# EAGLE schematic Talon_SDI12 (EAGLE 9.6.2)

## Sheet 1 of 3: Power
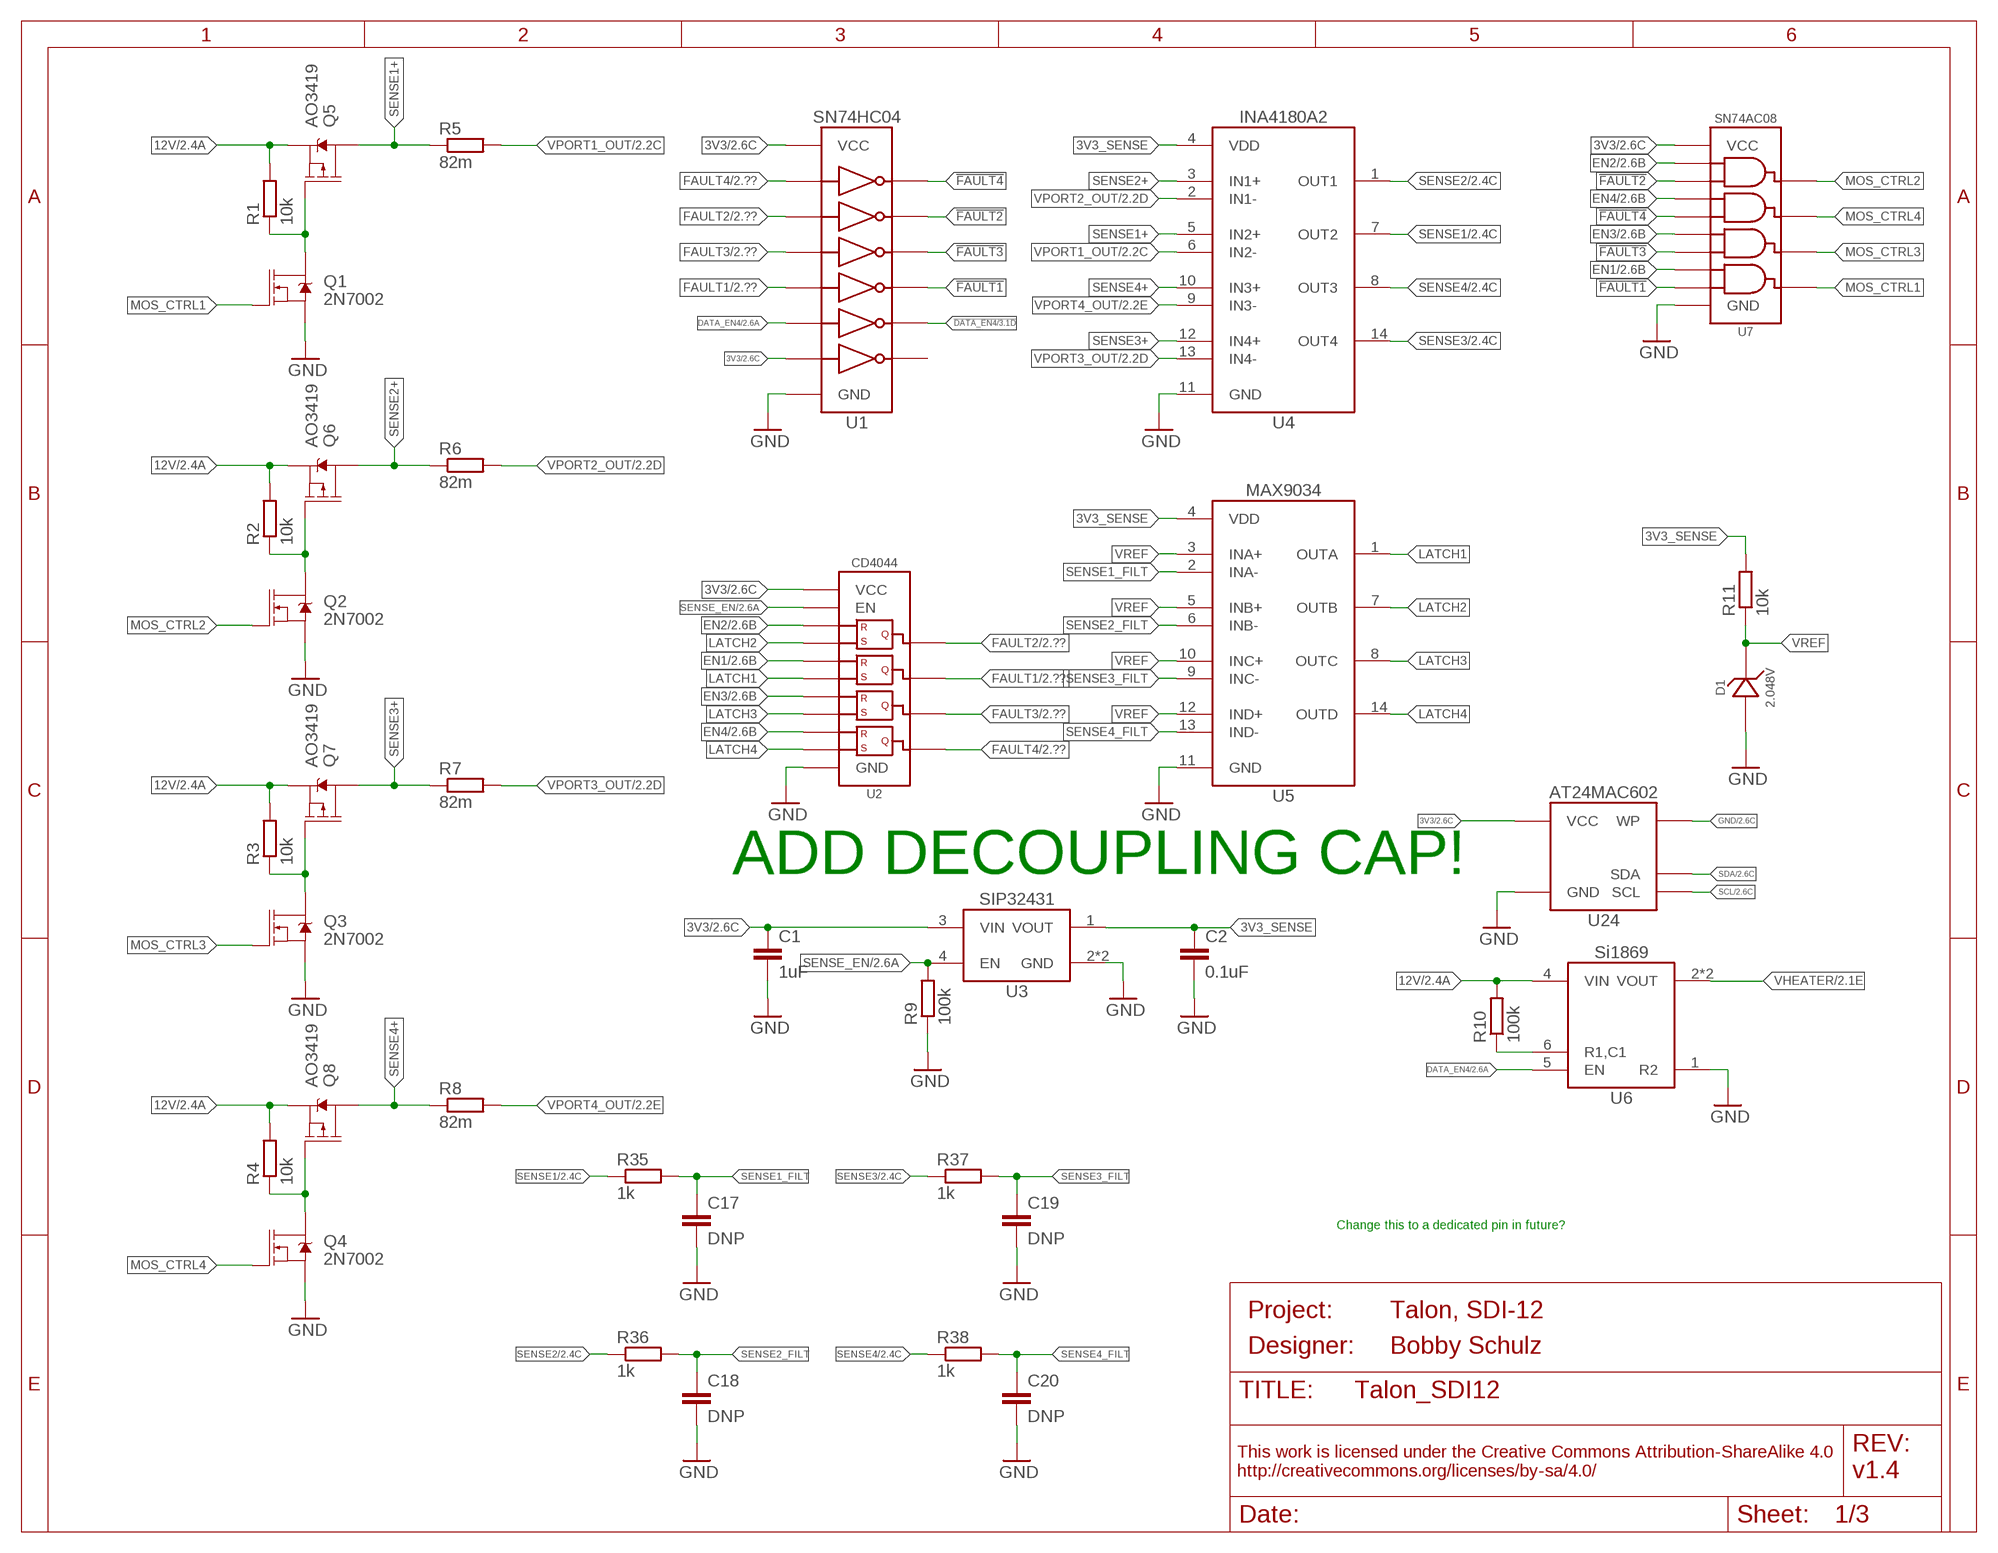
[diagram p0: schematic, sheet 1]
FRAME1 (FRAME_A_L): DESIGNER: Bobby Schulz; PROJECT: Talon, SDI-12; REV: v1.4

### Parts
C1  1uF  C-EU1UFC0603  [C0603]
C2  0.1uF  C-EU0.1UFC0402  [C0402]
C17  DNP  C-EU0.1UFC0402  [C0402]
C18  DNP  C-EU0.1UFC0402  [C0402]
C19  DNP  C-EU0.1UFC0402  [C0402]
C20  DNP  C-EU0.1UFC0402  [C0402]
D1  2.048V  LM40402.048  [SOT23-3]
Q1  2N7002  MOSFET-NCH-2N7002P  [SOT23-3]
Q2  2N7002  MOSFET-NCH-2N7002P  [SOT23-3]
Q3  2N7002  MOSFET-NCH-2N7002P  [SOT23-3]
Q4  2N7002  MOSFET-NCH-2N7002P  [SOT23-3]
Q5  AO3419  MOSFET-PCH-AO3419  [SOT23-3]
Q6  AO3419  MOSFET-PCH-AO3419  [SOT23-3]
Q7  AO3419  MOSFET-PCH-AO3419  [SOT23-3]
Q8  AO3419  MOSFET-PCH-AO3419  [SOT23-3]
R1  10k  R-EU_10KR0402  [R0402]
R2  10k  R-EU_10KR0402  [R0402]
R3  10k  R-EU_10KR0402  [R0402]
R4  10k  R-EU_10KR0402  [R0402]
R5  82m  R-EU_0.082R0603  [R0603]
R6  82m  R-EU_0.082R0603  [R0603]
R7  82m  R-EU_0.082R0603  [R0603]
R8  82m  R-EU_0.082R0603  [R0603]
R9  100k  R-EU_100KR0402  [R0402]
R10  100k  R-EU_100KR0402  [R0402]
R11  10k  R-EU_10KR0402  [R0402]
R35  1k  R-EU_1KR0402  [R0402]
R36  1k  R-EU_1KR0402  [R0402]
R37  1k  R-EU_1KR0402  [R0402]
R38  1k  R-EU_1KR0402  [R0402]
U1  SN74HC04  [TSSOP14]
U2  CD4044  [TSSOP16]
U3  SIP32431TDFN  [TDFN_4]
U4  INA4180A2  [TSSOP14]
U5  MAX9034TSSOP  [TSSOP14]
U6  SI1869  [SC-70_6]
U7  SN74AC08  [TSSOP14]
U24  AT24MAC602SOT23  [SOT23-5]

### Nets
3V3: C1.1 U1.13(A6) U1.14(VCC) U2.16(VCC) U3.3(VIN) U7.14(VCC) U24.4(VCC) ; also sheet 2,3
3V3_SENSE: C2.1 R11.2 U3.1(VOUT) U4.4(VDD) U5.4(VDD)
12V: Q5.2(S) Q6.2(S) Q7.2(S) Q8.2(S) R1.2 R2.2 R3.2 R4.2 R10.2 U6.4(VIN) ; also sheet 2
!DATA_EN4: U1.10(Y5) ; also sheet 3
!FAULT1: U1.8(Y4) U7.13(B4)
!FAULT2: U1.4(Y2) U7.2(B1)
!FAULT3: U1.6(Y3) U7.10(B3)
!FAULT4: U1.2(Y1) U7.5(B2)
DATA_EN4: U1.11(A5) U6.5(EN) ; also sheet 2
EN1: U2.6(R2) U7.12(A4) ; also sheet 2
EN2: U2.4(R1) U7.1(A1) ; also sheet 2
EN3: U2.12(R3) U7.9(A3) ; also sheet 2
EN4: U2.14(R4) U7.4(A2) ; also sheet 2
FAULT1: U1.9(A4) U2.9(Q2) ; also sheet 2
FAULT2: U1.3(A2) U2.13(Q1) ; also sheet 2
FAULT3: U1.5(A3) U2.10(Q3) ; also sheet 2
FAULT4: U1.1(A1) U2.1(Q4) ; also sheet 2
GND: C1.2 C2.2 C17.2 C18.2 C19.2 C20.2 D1.2(A) Q1.2(S) Q2.2(S) Q3.2(S) Q4.2(S) R9.1 U1.7(GND) U2.8(GND) U3.2(GND) U3.EP(GND) U4.11(GND) U5.11(GND) U6.1(R2) U7.7(GND) U24.2(GND) U24.5(WP) ; also sheet 2,3
LATCH1: U2.7(S2) U5.1(OUTA)
LATCH2: U2.3(S1) U5.7(OUTB)
LATCH3: U2.11(S3) U5.8(OUTC)
LATCH4: U2.15(S4) U5.14(OUTD)
MOS_CTRL1: Q1.1(G) U7.11(Y4)
MOS_CTRL2: Q2.1(G) U7.3(Y1)
MOS_CTRL3: Q3.1(G) U7.8(Y3)
MOS_CTRL4: Q4.1(G) U7.6(Y2)
N$1: Q2.3(D) Q6.1(G) R2.1
N$2: Q1.3(D) Q5.1(G) R1.1
N$3: Q3.3(D) Q7.1(G) R3.1
N$4: Q4.3(D) Q8.1(G) R4.1
N$11: R10.1 U6.6(R1,C1)
SCL: U24.1(SCL) ; also sheet 2,3
SDA: U24.3(SDA) ; also sheet 2,3
SENSE1: R35.1 U4.7(OUT2) ; also sheet 2
SENSE1+: Q5.3(D) R5.1 U4.5(IN2+)
SENSE1_FILT: C17.1 R35.2 U5.2(INA-)
SENSE2: R36.1 U4.1(OUT1) ; also sheet 2
SENSE2+: Q6.3(D) R6.1 U4.3(IN1+)
SENSE2_FILT: C18.1 R36.2 U5.6(INB-)
SENSE3: R37.1 U4.14(OUT4) ; also sheet 2
SENSE3+: Q7.3(D) R7.1 U4.12(IN4+)
SENSE3_FILT: C19.1 R37.2 U5.9(INC-)
SENSE4: R38.1 U4.8(OUT3) ; also sheet 2
SENSE4+: Q8.3(D) R8.1 U4.10(IN3+)
SENSE4_FILT: C20.1 R38.2 U5.13(IND-)
SENSE_EN: R9.2 U2.5(EN) U3.4(EN) ; also sheet 2
VHEATER: U6.2(VOUT) U6.3(VOUT) ; also sheet 2
VPORT1_OUT: R5.2 U4.6(IN2-) ; also sheet 2
VPORT2_OUT: R6.2 U4.2(IN1-) ; also sheet 2
VPORT3_OUT: R7.2 U4.13(IN4-) ; also sheet 2
VPORT4_OUT: R8.2 U4.9(IN3-) ; also sheet 2
VREF: D1.1(C) R11.1 U5.3(INA+) U5.5(INB+) U5.10(INC+) U5.12(IND+)
Unconnected: U1.12(Y6)

### Notes on the sheet
- ADD DECOUPLING CAP!
- Change this to a dedicated pin in future?

## Sheet 2 of 3: Core
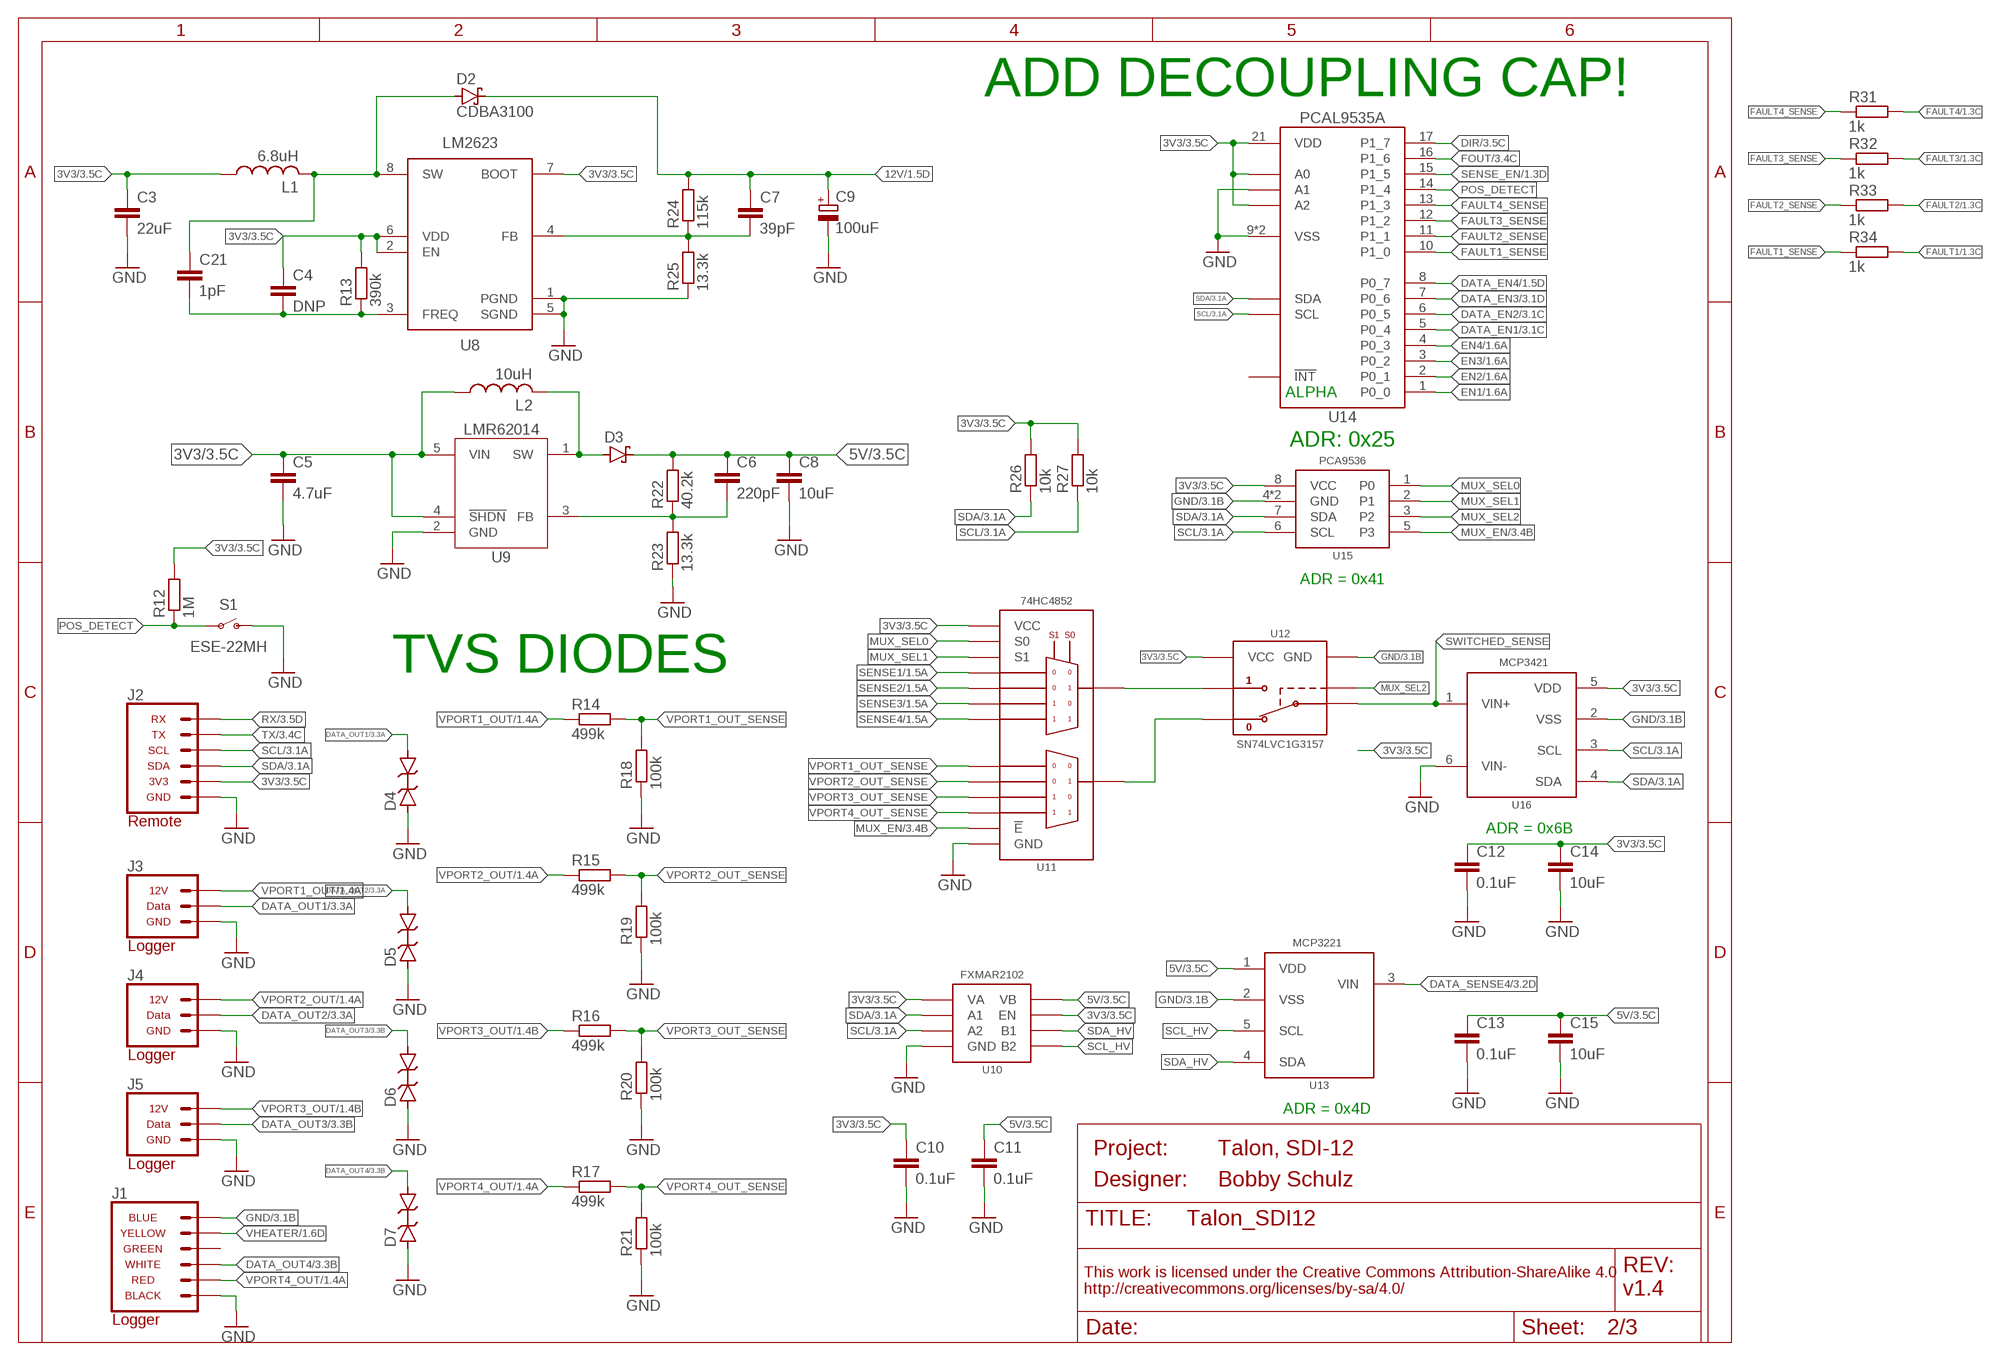
[diagram p1: schematic, sheet 2]
FRAME2 (FRAME_A_L): DESIGNER: Bobby Schulz; PROJECT: Talon, SDI-12; REV: v1.4

### Parts
C3  22uF  C-EU22UFC0805  [C0805]
C4  DNP  C-EU0.1UFC0402  [C0402]
C5  4.7uF  C-EU4.7UFC0805  [C0805]
C6  220pF  C-EU220PFC0603  [C0603]
C7  39pF  C-EU39PFC0402  [C0402]
C8  10uF  C-EU10UFC0805  [C0805]
C9  100uF  CTANT_EU2917  [C2917]
C10  0.1uF  C-EU0.1UFC0402  [C0402]
C11  0.1uF  C-EU0.1UFC0402  [C0402]
C12  0.1uF  C-EU0.1UFC0402  [C0402]
C13  0.1uF  C-EU0.1UFC0402  [C0402]
C14  10uF  C-EU10UFC0805  [C0805]
C15  10uF  C-EU10UFC0805  [C0805]
C21  1pF  C-EU1PFC0402  [C0402]
D2  CDBA3100  DIODE_SCHOTTKYDO-214AC  [DO214AC]
D3  DIODE_SCHOTTKYSOD-123  [SOD-123]
D4  12V  DIODE_ESD_BI_D5V0L1_0402  [D0402]
D5  12V  DIODE_ESD_BI_D5V0L1_0402  [D0402]
D6  12V  DIODE_ESD_BI_D5V0L1_0402  [D0402]
D7  12V  DIODE_ESD_BI_D5V0L1_0402  [D0402]
J1  CONN_APOGEE_LOGGER  [1X06_M8_PHOENIX_1456022_BOARDLOCK]
J2  CONN_TALON_REMOTE  [1X06_MICROLOCKPLUS]
J3  CONN_SDI-12_LOGGERM8_TE_BOARDLOCK  [1X03_M8_TE_T40410_BOARDLOCK]
J4  CONN_SDI-12_LOGGERM8_TE_BOARDLOCK  [1X03_M8_TE_T40410_BOARDLOCK]
J5  CONN_SDI-12_LOGGERM8_TE_BOARDLOCK  [1X03_M8_TE_T40410_BOARDLOCK]
L1  6.8uH  INDUCTOR_MAIA_4.1X4.1  [WE-MAIA(4.1X4.1)]
L2  10uH  INDUCTOR_1008  [1008]
R12  1M  R-EU_1MR0402  [R0402]
R13  390k  R-EU_390KR0603  [R0603]
R14  499k  R-EU_499KR0603  [R0603]
R15  499k  R-EU_499KR0603  [R0603]
R16  499k  R-EU_499KR0603  [R0603]
R17  499k  R-EU_499KR0603  [R0603]
R18  100k  R-EU_100KR0402  [R0402]
R19  100k  R-EU_100KR0402  [R0402]
R20  100k  R-EU_100KR0402  [R0402]
R21  100k  R-EU_100KR0402  [R0402]
R22  40.2k  R-EU_40.2KR0603  [R0603]
R23  13.3k  R-EU_13.3KR0603  [R0603]
R24  115k  R-EU_115KR0603  [R0603]
R25  13.3k  R-EU_13.3KR0603  [R0603]
R26  10k  R-EU_10KR0402  [R0402]
R27  10k  R-EU_10KR0402  [R0402]
R31  1k  R-EU_1KR0402  [R0402]
R32  1k  R-EU_1KR0402  [R0402]
R33  1k  R-EU_1KR0402  [R0402]
R34  1k  R-EU_1KR0402  [R0402]
S1  ESE-22MH  SPSTESE-22MH  [ESE-22MH]
U8  LM2621  [DGK_S-PDSO-G8]
U9  LMR62014SOT23  [DBV0005A]
U10  FXMAR2102UMLP  [UQFN-8_1.4X1.2]
U11  74HC4852  [VQFN-16]
U12  SN74LVC1G3157SC70  [DCK_R-PDSO-G6]
U13  MCP3221  [SOT23-5]
U14  PCAL9535AQFN  [QFN24]
U15  PCA9536DFN  [DFN_8_3X3]
U16  MCP3421A3  [SOT23-6L]

### Nets
3V3: C3.1 C4.1 C5.1 C10.1 C12.1 C14.1 J2.2(3V3) L1.P$1 L2.1 R12.2 R13.2 R26.2 R27.2 U8.2(EN) U8.6(VDD) U8.7(BOOT) U9.4(!SHDN) U9.5(VIN) U10.1(VA) U10.5(EN) U11.16(VCC) U12.5(VCC) U14.18(A0) U14.21(VDD) U14.24(A2) U15.8(VCC) U16.5(VDD) ; also sheet 1,3
5V: C6.1 C8.1 C11.1 C13.1 C15.1 D3.CAT(C) R22.2 U10.8(VB) U13.1(VDD) ; also sheet 3
12V: C7.1 C9.+ D2.C R24.2 ; also sheet 1
DATA_EN1: U14.5(P0_4) ; also sheet 3
DATA_EN2: U14.6(P0_5) ; also sheet 3
DATA_EN3: U14.7(P0_6) ; also sheet 3
DATA_EN4: U14.8(P0_7) ; also sheet 1
DATA_OUT1: D4.2(C) J3.4(DATA) ; also sheet 3
DATA_OUT2: D5.2(C) J4.4(DATA) ; also sheet 3
DATA_OUT3: D6.2(C) J5.4(DATA) ; also sheet 3
DATA_OUT4: D7.2(C) J1.3 ; also sheet 3
DATA_SENSE4: U13.3(VIN) ; also sheet 3
DIR: U14.17(P1_7) ; also sheet 3
EN1: U14.1(P0_0) ; also sheet 1
EN2: U14.2(P0_1) ; also sheet 1
EN3: U14.3(P0_2) ; also sheet 1
EN4: U14.4(P0_3) ; also sheet 1
FAULT1: R34.2 ; also sheet 1
FAULT1_SENSE: R34.1 U14.10(P1_0)
FAULT2: R33.2 ; also sheet 1
FAULT2_SENSE: R33.1 U14.11(P1_1)
FAULT3: R32.2 ; also sheet 1
FAULT3_SENSE: R32.1 U14.12(P1_2)
FAULT4: R31.2 ; also sheet 1
FAULT4_SENSE: R31.1 U14.13(P1_3)
FOUT: U14.16(P1_6) ; also sheet 3
GND: C3.2 C5.2 C8.2 C9.- C10.2 C11.2 C12.2 C13.2 C14.2 C15.2 D4.1(A) D5.1(A) D6.1(A) D7.1(A) J1.1 J1.6 J2.1(GND) J3.3(GND) J4.3(GND) J5.3(GND) R18.1 R19.1 R20.1 R21.1 R23.1 R25.1 S1.1(O) U8.1(PGND) U8.5(SGND) U9.2(GND) U10.4(GND) U11.8(GND) U11.EP(GND) U12.2(GND) U13.2(VSS) U14.9(VSS) U14.23(A1) U14.EP(VSS) U15.4(GND) U15.EP(GND) U16.2(VSS) U16.6(VIN-) ; also sheet 1,3
MUX_EN: U11.6(!E) U15.5(P3) ; also sheet 3
MUX_SEL0: U11.10(S0) U15.1(P0)
MUX_SEL1: U11.9(S1) U15.2(P1)
MUX_SEL2: U12.6(S) U15.3(P2)
N$7: C4.2 C21.2 R13.1 U8.3(FREQ)
N$8: C21.1 D2.A L1.P$2 U8.8(SW)
N$9: C7.2 R24.1 R25.2 U8.4(FB)
N$10: C6.2 R22.1 R23.2 U9.3(FB)
N$18: U11.3(2Z) U12.3(B1)
N$38: U11.13(1Z) U12.1(B2)
POS_DETECT: R12.1 S1.2(P) U14.14(P1_4)
RX: J2.6(RX) ; also sheet 3
SCL: J2.4(SCL) R27.1 U10.3(A2) U14.19(SCL) U15.6(SCL) U16.3(SCL) ; also sheet 1,3
SCL_HV: U10.6(B2) U13.5(SCL)
SDA: J2.3(SDA) R26.1 U10.2(A1) U14.20(SDA) U15.7(SDA) U16.4(SDA) ; also sheet 1,3
SDA_HV: U10.7(B1) U13.4(SDA)
SENSE1: U11.12(1Y0) ; also sheet 1
SENSE2: U11.14(1Y1) ; also sheet 1
SENSE3: U11.15(1Y2) ; also sheet 1
SENSE4: U11.11(1Y3) ; also sheet 1
SENSE_EN: U14.15(P1_5) ; also sheet 1
SW1: D3.ANODE(A) L2.2 U9.1(SW)
SWITCHED_SENSE: U12.4(A) U16.1(VIN+)
TX: J2.5(TX) ; also sheet 3
VHEATER: J1.5 ; also sheet 1
VPORT1_OUT: J3.1(12V) R14.1 ; also sheet 1
VPORT1_OUT_SENSE: R14.2 R18.2 U11.1(2Y0)
VPORT2_OUT: J4.1(12V) R15.1 ; also sheet 1
VPORT2_OUT_SENSE: R15.2 R19.2 U11.5(2Y1)
VPORT3_OUT: J5.1(12V) R16.1 ; also sheet 1
VPORT3_OUT_SENSE: R16.2 R20.2 U11.2(2Y2)
VPORT4_OUT: J1.2 R17.1 ; also sheet 1
VPORT4_OUT_SENSE: R17.2 R21.2 U11.4(2Y3)
Unconnected: J1.4 U14.22(!INT)

### Notes on the sheet
- ADD DECOUPLING CAP!
- ALPHA
- ADR: 0x25
- ADR = 0x41
- TVS DIODES
- ADR = 0x6B
- ADR = 0x4D

## Sheet 3 of 3: SDI12 Interface
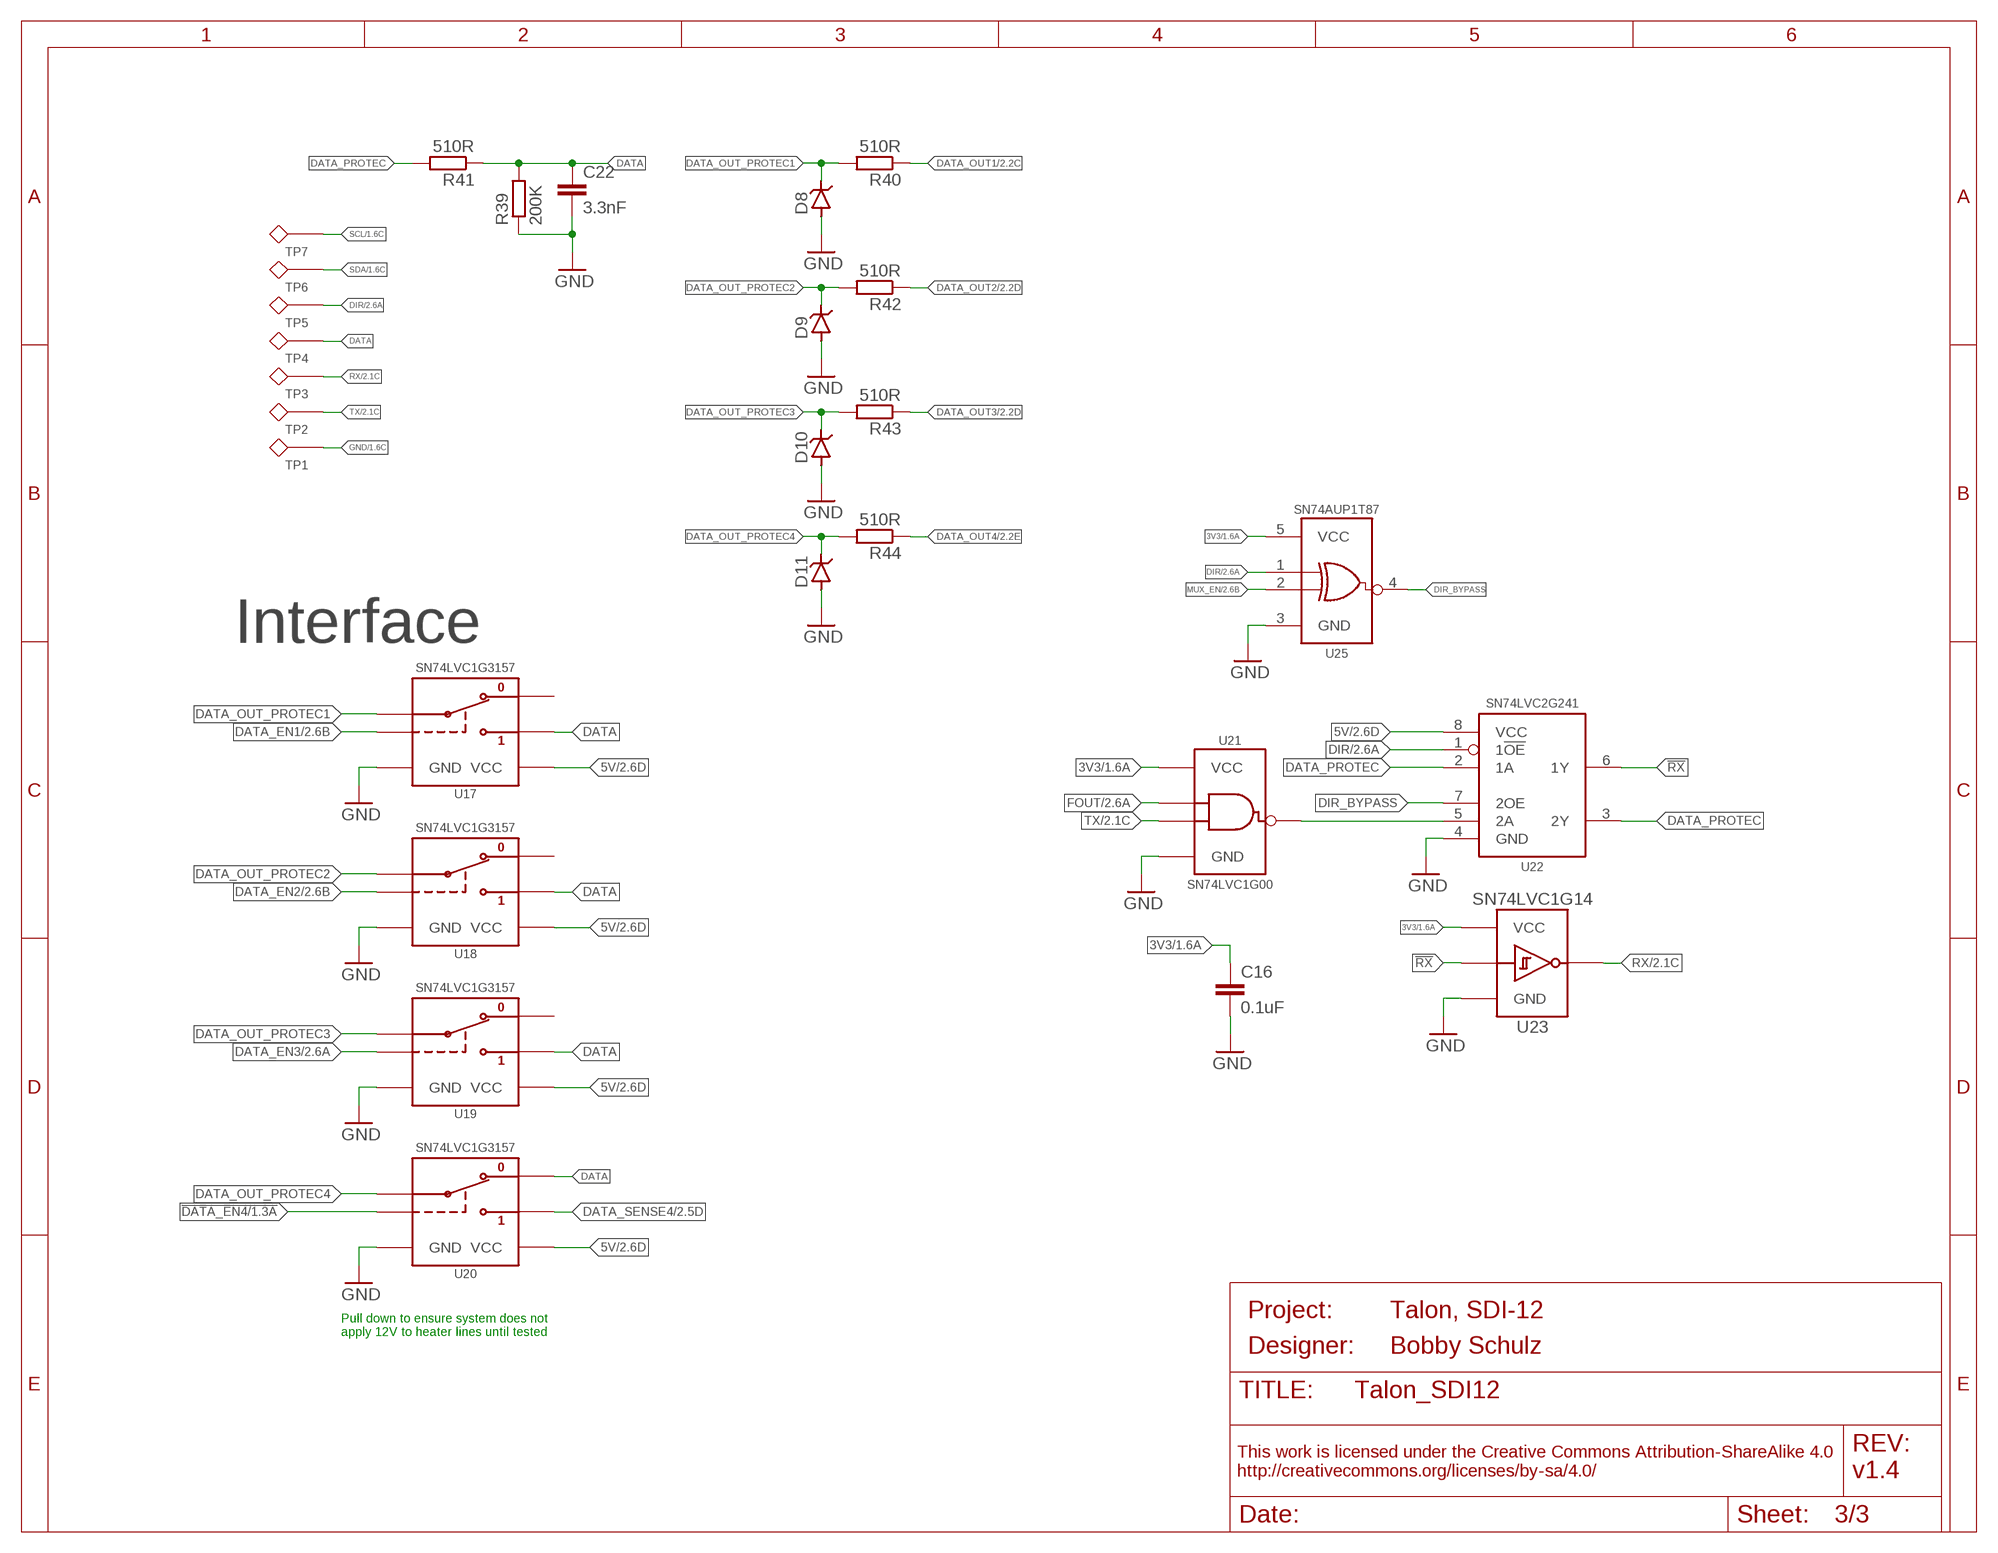
[diagram p2: schematic, sheet 3]
FRAME3 (FRAME_A_L): DESIGNER: Bobby Schulz; PROJECT: Talon, SDI-12; REV: v1.4

### Parts
C16  0.1uF  C-EU0.1UFC0402  [C0402]
C22  3.3nF  C-EU3.3NFC0402  [C0402]
D8  DIODE_ZENERSOD-323  [SOD323-R]
D9  DIODE_ZENERSOD-323  [SOD323-R]
D10  DIODE_ZENERSOD-323  [SOD323-R]
D11  DIODE_ZENERSOD-323  [SOD323-R]
R39  200K  R-EU_200KR0402  [R0402]
R40  510R  R-EU_510R0402  [R0402]
R41  510R  R-EU_510R0402  [R0402]
R42  510R  R-EU_510R0402  [R0402]
R43  510R  R-EU_510R0402  [R0402]
R44  510R  R-EU_510R0402  [R0402]
TP1  TESTPOINTRCU  [TESTPOINT_0603]
TP2  TESTPOINTRCU  [TESTPOINT_0603]
TP3  TESTPOINTRCU  [TESTPOINT_0603]
TP4  TESTPOINTRCU  [TESTPOINT_0603]
TP5  TESTPOINTRCU  [TESTPOINT_0603]
TP6  TESTPOINTRCU  [TESTPOINT_0603]
TP7  TESTPOINTRCU  [TESTPOINT_0603]
U17  SN74LVC1G3157SC70  [DCK_R-PDSO-G6]
U18  SN74LVC1G3157SC70  [DCK_R-PDSO-G6]
U19  SN74LVC1G3157SC70  [DCK_R-PDSO-G6]
U20  SN74LVC1G3157SC70  [DCK_R-PDSO-G6]
U21  SN74LVC1G00SC70  [DCK_R-PDSO-G5]
U22  SN74LVC2G241DCU  [DCU_(R-PDSO-G8)]
U23  SN74LVC1G14DCK  [DCK_R-PDSO-G5]
U25  SN74AUP1T87  [DCK_R-PDSO-G5]

### Nets
3V3: C16.1 U21.5(VCC) U23.5(VCC) U25.5(VCC) ; also sheet 1,2
5V: U17.5(VCC) U18.5(VCC) U19.5(VCC) U20.5(VCC) U22.8(VCC) ; also sheet 2
!DATA_EN4: U20.6(S) ; also sheet 1
!RX: U22.6(1Y) U23.2(A)
DATA: C22.1 R39.2 R41.1 TP4.1 U17.1(B2) U18.1(B2) U19.1(B2) U20.3(B1)
DATA_EN1: U17.6(S) ; also sheet 2
DATA_EN2: U18.6(S) ; also sheet 2
DATA_EN3: U19.6(S) ; also sheet 2
DATA_OUT1: R40.1 ; also sheet 2
DATA_OUT2: R42.1 ; also sheet 2
DATA_OUT3: R43.1 ; also sheet 2
DATA_OUT4: R44.1 ; also sheet 2
DATA_OUT_PROTEC1: D8.C R40.2 U17.4(A)
DATA_OUT_PROTEC2: D9.C R42.2 U18.4(A)
DATA_OUT_PROTEC3: D10.C R43.2 U19.4(A)
DATA_OUT_PROTEC4: D11.C R44.2 U20.4(A)
DATA_PROTEC: R41.2 U22.2(1A) U22.3(2Y)
DATA_SENSE4: U20.1(B2) ; also sheet 2
DIR: TP5.1 U22.1(1!OE) U25.1(A) ; also sheet 2
DIR_BYPASS: U22.7(2OE) U25.4(Y)
FOUT: U21.1(A) ; also sheet 2
GND: C16.2 C22.2 D8.A D9.A D10.A D11.A R39.1 TP1.1 U17.2(GND) U18.2(GND) U19.2(GND) U20.2(GND) U21.3(GND) U22.4(GND) U23.3(GND) U25.3(GND) ; also sheet 1,2
MUX_EN: U25.2(B) ; also sheet 2
N$5: U21.4(Y) U22.5(2A)
RX: TP3.1 U23.4(Y) ; also sheet 2
SCL: TP7.1 ; also sheet 1,2
SDA: TP6.1 ; also sheet 1,2
TX: TP2.1 U21.2(B) ; also sheet 2
Unconnected: U17.3(B1) U18.3(B1) U19.3(B1)

### Notes on the sheet
- Interface
- Pull down to ensure system does not 
  apply 12V to heater lines until tested

## Library data of the parts
C1 = bschulz_passives:C-EU: CAPACITOR, European symbol; DIGIKEY: 587-2984-1-ND; MF: Yaiyo Yuden; MPN: TMK107B7105KA-T
C2 C10-C13 C16 = bschulz_passives:C-EU: CAPACITOR, European symbol; DIGIKEY: 490-4759-1-ND; MF: Murata; MPN: GCM155R71C104KA55D
C3 = bschulz_passives:C-EU: CAPACITOR, European symbol; DIGIKEY: 490-9952-1-ND; MF: Murata; MPN: GRM219R61C226ME15L
C4 C17-C20 = bschulz_passives:C-EU: CAPACITOR, European symbol; DIGIKEY: DNP; MF: N/A; MPN: DNP
C5 = bschulz_passives:C-EU: CAPACITOR, European symbol; DIGIKEY: 399-7415-1-ND; MF: Kemet; MPN: C0805C475K4RACTU
C6 = bschulz_passives:C-EU: CAPACITOR, European symbol; DIGIKEY: 399-1066-1-ND; MF: Kemet; MPN: C0603C221J5GACTU
C7 = bschulz_passives:C-EU: CAPACITOR, European symbol; DIGIKEY: 399-1018-1-ND; MF: Kemet; MPN: C0402C390J5GAC7867
C8 = bschulz_passives:C-EU: CAPACITOR, European symbol; DIGIKEY: 587-2985-1-ND; MF: Taiyo Yuden; MPN: TMK212BBJ106KG-T
C9 = bschulz_passives:CTANT_EU: Genaric Tantalum Capacitor; DIGIKEY: 718-293D107X0016D2TE3CT-ND; MF: Vishay; MPN: 293D107X0016D2TE3
C14 C15 = bschulz_passives:C-EU: CAPACITOR, European symbol; DIGIKEY: 490-6473-1-ND; MF: Murata; MPN: GRM21BR61C106KE15K
C21 = bschulz_passives:C-EU: CAPACITOR, European symbol; DIGIKEY: 490-6073-1-ND; MF: Murata; MPN: GJM1555C1H1R0BB01D
C22 = bschulz_passives:C-EU: CAPACITOR, European symbol; DIGIKEY: 311-1034-1-ND; MF: Yageo; MPN: CC0402KRX7R9BB332
D1 = bschulz:LM4040: LM4040 - Precision Micropower Shunt Voltage Referance Characteristics: VReverseBreakdown: 1.225V, 2.5V, 4.096V, 5.0V Output Current: 15 mA Tolerance: 1% Temp Coeficient: ±15ppm/C° Operating Temperature: -40°C to 85°C Digikey: 576-1047-1-ND (Microchip, 2.5V) <https://www.digikey.com/product-detail/en/microchip-technology/LM4040DYM3-2.5-TR/576-1047-1-ND/771818> 576-1048-1-ND (Microchip, 4.096V) <https://www.digikey.com/product-detail/en/microchip-technology/LM4040DYM3-4.1-TR/576-1048-1-ND/771819> 5LM4040CIM3-2.0/NOPBCT-ND (TI, 2.048V) <https://www.digikey.com/product-detail/en/texas-instruments/LM4040CIM3-2.0-NOPB/LM4040CIM3-2.0-NOPBCT-ND/2350623>; DIGIKEY: LM4040CIM3-2.0/NOPBCT-ND; MF: TI; MPN: LM4040CIM3-2.0/NOPB
D2 = bschulz:DIODE_SCHOTTKY: Generic Shottky Diode; DIGIKEY: 641-1747-1-ND; MF: Comchip; MPN: CDBA3100-HF
D3 = bschulz:DIODE_SCHOTTKY: Generic Shottky Diode; DIGIKEY: MBR0520LT1GOSCT-ND; MF: ON Semiconductor; MPN: MBR0520LT1G
D4-D7 = bschulz:DIODE_ESD_BI: Generic Bidirectional ESD Diode; DIGIKEY: D12V0L1B2LP-7BDICT-ND; MF: Diodes Inc; MPN: D12V0L1B2LP-7B; VALUE: 6V
D8-D11 = bschulz:DIODE_ZENER: Generic Zener Diode; DIGIKEY: BZX384B5V1-HE3-08GICT-ND; MF: Vishay; MPN: BZX384B5V1-HE3-08
J1 = GEMS_Plugs:CONN_APOGEE_LOGGER: GEMS Connector for Apogee Devices; DIGIKEY: 277-17111-ND; DISP: Logger; MF: Phoenix Contact; MPN: 1456022
J2 = GEMS_Plugs:CONN_TALON: GEMS Connector for Talon Interface; DIGIKEY: 900-2059570671CT-ND; DISP: Remote; MF: Molex; MPN: 2059570671
J3-J5 = GEMS_Plugs:CONN_SDI-12_LOGGER: SDI-12 Connector; DIGIKEY: A126811-ND; DISP: Logger; MF: TE Connectivity; MPN: T4041037031-000
L1 = bschulz:INDUCTOR: Genaric Inductor; DIGIKEY: 732-11744-1-ND; MF: Wurth; MPN: 78438357068
L2 = bschulz:INDUCTOR: Genaric Inductor; DIGIKEY: 732-4851-1-ND; MF: Wurth; MPN: 74438323100
Q1-Q4 = bschulz:MOSFET-NCH: N-channel MOSFET Small Signal/Low Power: BSS138 2N7002P 2N7002PW RE1C002UN; DIGIKEY: 1727-4692-1-ND; MF: Nexperia; MPN: 2N7002P,215
Q5-Q8 = bschulz:MOSFET-PCH: P-channel MOSFET Small Signal/Low Power:; DIGIKEY: 785-1013-1-ND; MF: Alpha and Omega; MPN: AO3419
R1-R4 R11 R26 R27 = bschulz_passives:R-EU_: RESISTOR, European symbol Digikey Parts: Yageo, 0402 Yageo, 0603 Panasonic, 0603 Panasonic, precision, 0603 Panasonic, 0805 Rohm, current sense Vishay, pulse proof automotive; DIGIKEY: 311-10.0KLRCT-ND; MF: Yageo; MPN: RC0402FR-0710KL; VALUE_PART: 10k
R5-R8 = bschulz_passives:R-EU_: RESISTOR, European symbol Digikey Parts: Yageo, 0402 Yageo, 0603 Panasonic, 0603 Panasonic, precision, 0603 Panasonic, 0805 Rohm, current sense Vishay, pulse proof automotive; DIGIKEY: 408-1446-1-ND; MF: Susumu; MPN: RL0816T-R082-F; VALUE_PART: 82m
R9 R10 R18-R21 = bschulz_passives:R-EU_: RESISTOR, European symbol Digikey Parts: Yageo, 0402 Yageo, 0603 Panasonic, 0603 Panasonic, precision, 0603 Panasonic, 0805 Rohm, current sense Vishay, pulse proof automotive; DIGIKEY: 311-100KLRCT-ND; MF: Yageo; MPN: RC0402FR-07100KL; VALUE_PART: 100k
R12 = bschulz_passives:R-EU_: RESISTOR, European symbol Digikey Parts: Yageo, 0402 Yageo, 0603 Panasonic, 0603 Panasonic, precision, 0603 Panasonic, 0805 Rohm, current sense Vishay, pulse proof automotive; DIGIKEY: 311-1.00MLRCT-ND; MF: Yageo; MPN: RC0402FR-071ML; VALUE_PART: 1M
R13 = bschulz_passives:R-EU_: RESISTOR, European symbol Digikey Parts: Yageo, 0402 Yageo, 0603 Panasonic, 0603 Panasonic, precision, 0603 Panasonic, 0805 Rohm, current sense Vishay, pulse proof automotive; DIGIKEY: 311-390KHRCT-ND; MF: Yageo; MPN: RC0603FR-07390KL; VALUE_PART: 390k
R14-R17 = bschulz_passives:R-EU_: RESISTOR, European symbol Digikey Parts: Yageo, 0402 Yageo, 0603 Panasonic, 0603 Panasonic, precision, 0603 Panasonic, 0805 Rohm, current sense Vishay, pulse proof automotive; DIGIKEY: 311-499KHRCT-ND; MF: Yageo; MPN: RC0603FR-07499KL; VALUE_PART: 499k
R22 = bschulz_passives:R-EU_: RESISTOR, European symbol Digikey Parts: Yageo, 0402 Yageo, 0603 Panasonic, 0603 Panasonic, precision, 0603 Panasonic, 0805 Rohm, current sense Vishay, pulse proof automotive; DIGIKEY: RMCF0603FT40K2CT-ND; MF: Stackpole; MPN: RMCF0603FT40K2; VALUE_PART: 40.2k
R23 R25 = bschulz_passives:R-EU_: RESISTOR, European symbol Digikey Parts: Yageo, 0402 Yageo, 0603 Panasonic, 0603 Panasonic, precision, 0603 Panasonic, 0805 Rohm, current sense Vishay, pulse proof automotive; DIGIKEY: 311-13.3KHRCT-ND; MF: Yageo; MPN: RC0603FR-0713K3L; VALUE_PART: 13.3k
R24 = bschulz_passives:R-EU_: RESISTOR, European symbol Digikey Parts: Yageo, 0402 Yageo, 0603 Panasonic, 0603 Panasonic, precision, 0603 Panasonic, 0805 Rohm, current sense Vishay, pulse proof automotive; DIGIKEY: 311-115KHRCT-ND; MF: Yageo; MPN: RC0603FR-07115KL; VALUE_PART: 115k
R31-R38 = bschulz_passives:R-EU_: RESISTOR, European symbol Digikey Parts: Yageo, 0402 Yageo, 0603 Panasonic, 0603 Panasonic, precision, 0603 Panasonic, 0805 Rohm, current sense Vishay, pulse proof automotive; DIGIKEY: 311-1.00KLRCT-ND; MF: Yageo; MPN: RC0402FR-071KL; VALUE_PART: 1k
R39 = bschulz_passives:R-EU_: RESISTOR, European symbol Digikey Parts: Yageo, 0402 Yageo, 0603 Panasonic, 0603 Panasonic, precision, 0603 Panasonic, 0805 Rohm, current sense Vishay, pulse proof automotive; DIGIKEY: 311-200KLRCT-ND; MF: Yageo; MPN: RC0402FR-07200KL; VALUE_PART: 200k
R40-R44 = bschulz_passives:R-EU_: RESISTOR, European symbol Digikey Parts: Yageo, 0402 Yageo, 0603 Panasonic, 0603 Panasonic, precision, 0603 Panasonic, 0805 Rohm, current sense Vishay, pulse proof automotive; DIGIKEY: 311-510LRCT-ND; MF: Yageo; MPN: RC0402FR-07510RL; VALUE_PART: 510
S1 = bschulz:SPST: Generic SPST (Single Pole Single Throw) Switch; DIGIKEY: P13584SCT-ND; MF: Panasonic; MPN: ESE-22MH24
TP1-TP7 = bschulz:TESTPOINT: Test Point; DIGIKEY: A106145CT-ND; MF: TE Connectivity; MPN: RCU-0C
U1 = bschulz:SN74HC04: SN74HC04 - NOT, 4 Element, 1 Input - Hex Inverter Characteristics: VCC: 2 ~ 6Vv IQ = <2μA Operating Temperature: -40°C to 85°C Digikey: 296-8208-1-ND <https://www.digikey.com/en/products/detail/texas-instruments/SN74HC04PWR/377033>; DIGIKEY: 296-8208-1-ND; MF: TI; MPN: SN74HC04PWR
U2 = bschulz:CD404*: CD404x - S-R Latch, Quad Characteristics: VCC: 3 ~ 18V Operating Temperature: -40°C to 85°C Digikey: CD4044; DIGIKEY: 296-31499-1-ND; DISP: CD4044; MF: TI; MPN: CD4044BPWR
U3 = bschulz:SIP3243*: SiP3243x - Ultra Low Leakage Load Switch with Reverse Blocking Characteristics: Vin: 1.5 ~ 5.5V IQ: 0.01 nA RDS(ON): 105mΩ (Vin = 5v), 135mΩ (Vin = 3v) Output Current: 1.4A Operating Temperature: -40°C to 125°C Digikey: SIP32431DNP3-T1GE4CT-ND <https://www.digikey.com/en/products/detail/SIP32431DNP3-T1GE4/SIP32431DNP3-T1GE4CT-ND/2673920?itemSeq=377306935>; DIGIKEY: SIP32431DNP3-T1GE4CT-ND; DISP: SIP32431; MF: Vishay; MPN: SIP32431DNP3-T1GE4
U4 = bschulz:INA4180: INA4180 - Analog Output Current Sense Amplifier Characteristics: Vs: 2.7V ~ 5V Iq: 690μA Common Mode Range: 0V ~ 26V Gain: 20, 50, 100, 200 V/V (A1, A2, A3, A4) Operating Temperature: -40°C to 125°C Digikey: INA4180A2 <https://www.digikey.com/en/products/detail/texas-instruments/INA4180A2IPWR/8676289>; DIGIKEY: 296-49095-1-ND; DISP: INA4180A2; MF: TI; MPN: INA4180A2IPWR
U5 = bschulz:MAX9034: MAX9034 - Ultra-Small nanoPower Single Comparator , Quad Characteristics: Vin: 2.5V ~ 5.5V Response Time: 188ns IQ: 35μA Internal Ref Operating Temperature: -40°C to 85°C Digikey: MAX9034AUD+CT-ND (TSSOP) <https://www.digikey.com/en/products/detail/maxim-integrated/MAX9034AUD-T/1498905>; DIGIKEY: MAX9034AUD+CT-ND; DISP: MAX9034; MF: Maxim; MPN: MAX9034AUD+T
U6 = bschulz:SI1869: Si1869 - Ultra Low Leakage Load Switch with Level Shift Characteristics: Vin: 1.8V~20V IQ: <1μA RDS(ON): 132mΩ (Vin = 4.5V) Output Current: 1.2A Operating Temperature: -55°C to 150°C Digikey: SI1869DH-T1-E3CT-ND <https://www.digikey.com/en/products/detail/vishay-siliconix/SI1869DH-T1-E3/1656323>; DIGIKEY: SI1869DH-T1-E3CT-ND; DISP: Si1869; MF: Vishay; MPN: SI1869DH-T1-E3
U7 = bschulz:SN74AC08: SN74AC08 - AND, 4 Element, 2 Input Characteristics: VCC: 2 ~ 6V IQ = <2μA Operating Temperature: -40°C to 85°C Digikey: 296-4292-1-ND <https://www.digikey.com/en/products/detail/texas-instruments/SN74AC08PWR/376110>; DIGIKEY: 296-4292-1-ND; MF: TI; MPN: SN74AC08PWR
U8 = bschulz:LM2621: LM2621 - Low Input Voltage, Step-Up DC-DC Converter Characteristics: Vin: 1.2V ~ 14V Vout: 1.24 ~ 14V Output Current: Up to 1A Quiescent Current: 80μA (typ) Operating Temperature: -40°C to 85°C Digikey: LM2621MMX/NOPBCT-ND <https://www.digikey.com/en/products/detail/texas-instruments/LM2621MMX-NOPB/366854>; DIGIKEY: LM2623AMM/NOPBCT-ND; DISP: LM2623; MF: TI; MPN: LM2623AMM/NOPB
U9 = bschulz:LMR62014: LMR62014 - Step-Up Boost Regulator Characteristics: Vin: 2.7V ~ 14V Vout: Vin ~ 20V Output Current (max): 1.4A IQ: 2mA (switching), 0.4mA (not switching), 24nA (shutdown) (typ) Operating Temperature: -40°C to 125°C Digikey: LMR62014XMF/NOPBCT-ND; DIGIKEY: LMR62014XMF/NOPBCT-ND; DISP: LMR62014; MF: TI; MPN: LMR62014XMF/NOPB
U10 = bschulz:FXMAR2102: FXMAR2102 - 2 Channel Bidirectional Voltage Level Translator for I2C Applications Characteristics: Vcc: 1.65 ~ 5.5V IQ: <5μA Output Current: 50mA Output Type: Open Drain/Push-Pull Operating Temperature: -40°C to 85°C Digikey: FXMAR2102UMX-F106CT-ND (UMLP) <https://www.digikey.com/en/products/detail/onsemi/FXMAR2102UMX-F106/5050715>; DIGIKEY: FXMAR2102UMX-F106CT-ND; DISP: FXMAR2102; MF: OnSemi; MPN: FXMAR2102UMX-F106
U11 = bschulz:74HC4852: 74HC4852 - Analog Multiplexer, Dual 4-Channel (1:4 x 2) Characteristics: VCC: 2 ~ 6V RON: 195Ω RCh-Ch: 3Ω, max Operating Temperature: -40°C to 85°C Digikey: 1727-7953-1-ND <https://www.digikey.com/en/products/detail/nexperia-usa-inc/74HC4852BQ-Q100-11/3678903>; DIGIKEY: 1727-7953-1-ND; DISP: 74HC4852; MF: Nexperia; MPN: 74HC4852BQ-Q100,11
U12 U17-U20 = bschulz:SN74LVC1G3157: SN74LVC1G3157 - SPDT Analog Switch Characteristics: VCC: 1.65~5.5V Operating Temperature: -40°C to 85°C On state resistace: 15 Ω, Max Channel to Channel Matching: 0.1 Ω, Typical Digikey: 296-14909-1-ND (SC70, DCK) <https://www.digikey.com/product-detail/en/texas-instruments/SN74LVC1G3157DCKR/296-14909-1-ND/562526> 296-18015-1-ND (SOT-666, DRL) <https://www.digikey.com/product-detail/en/texas-instruments/SN74LVC1G3157DRLR/296-18015-1-ND/770530>; DIGIKEY: 296-14909-1-ND; DISP: SN74LVC1G3157; MF: TI; MPN: SN74LVC1G3157DCKR
U13 = bschulz:MCP3221: MCP342* - SAR ADC Characteristics: VCC: 2.7~5.5V Operating Temperature: -40°C to 125°C Number of Inputs: 1 Sample Rate: 22.3k Samples Per Second Number of Bits: 12 Digikey: MCP3221A5T-I/OTCT-ND; DIGIKEY: MCP3221A5T-I/OTCT-ND; DISP: MCP3221; MF: TI; MPN: MCP3221A5T-I/OT
U14 = bschulz:PCAL95*5A: PCAL95*5A - I2C I/O Expander, 16 bit wtih interrupt and agile IO Characteristics: Vcc: 1.65V ~ 5.5V IOut: 25 mA IQ: 1μA Operating Temperature: -40°C to 85°C Internal Configurable Pullups/Pulldown* Digikey: 568-9947-1-ND (PCAL9535A, QFN) <https://www.digikey.com/en/products/detail/nxp-usa-inc/PCAL9535AHF-128/3721166> 568-9952-1-ND (PCAL9555A, QFN) <https://www.digikey.com/en/products/detail/nxp-usa-inc/PCAL9555AHF-128/3598045> *PCAL9555A has pullups enabled by default, but remain configurable; DIGIKEY: 568-9947-1-ND; DISP: PCAL9535A; MF: NXP; MPN: PCAL9535AHF,128
U15 = bschulz:PCA9536: PCA9536 - I2C I/O Expander, 4 bit, 5V tollerant Characteristics: Vcc: 2.3V ~ 5.5V IOut: >10mA IQ: 1μA Operating Temperature: -40°C to 85°C Internal Pullups Digikey: 296-20952-1-ND (DGK) <https://www.digikey.com/product-detail/en/texas-instruments/PCA9536DGKR/296-20952-1-ND/1216922> 568-4079-1-ND (SON) <https://www.digikey.com/en/products/detail/nxp-usa-inc/PCA9536TK-118/1300978> *Datasheet for PCA9536TK does not explicitly specify connection of exposed pad, but using information from NXP engineering bulletin EB806 <https://www.nxp.com/docs/en/engineering-bulletin/EB806.pdf> for justification for connecting EP to GND. See page 4 "Freescale [NXP] recommends electrically connecting the exposed pad of QFN and DFN devices to MCU ground..."; DIGIKEY: 568-4079-1-ND; MF: NXP; MPN: PCA9536TK,118
U16 = bschulz:MCP342*: MCP342* - Sigma Delta ADC Characteristics: VCC: 2.7~5.5V Operating Temperature: -40°C to 125°C Number of Inputs: 1 (Differenital) Sample Rate: 15 Samples Per Second Number of Bits: 16 (MCP3425), 18 (MCP3421) Digikey: MCP3421 MCP3425A0T-E/CHCT-ND MCP3425 MCP3421A0T-E/CHCT-ND MCP3421A1T-E/CHCT-ND MCP3421A3T-E/CHCT-ND; DIGIKEY: MCP3421A3T-E/CHCT-ND; DISP: MCP3421; MF: Microchip; MPN: MCP3421A3T-E/CH
U21 = bschulz:SN74LVC1G00; DIGIKEY: 296-9846-1-ND; DISP: SN74LVC1G00; MPN: SN74LVC1G00DCKR
U22 = bschulz:SN74LVC2G241: SN74LVC2G241 - Dual Buffer and Driver with 3-State Outputs Characteristics: VCC: 1.65~5.5V Operating Temperature: -40°C to 85°C Number of Bits: 2 /li> Inverting: No 5V Tolerent Input (Down Shift) Digikey: 296-32323-1-ND (VSSOP, DCU) <https://www.digikey.com/en/products/detail/texas-instruments/SN74LVC2G241DCUT/1592289>; DIGIKEY: 296-32323-1-ND; MF: TI; MPN: SN74LVC2G241DCUT
U23 = bschulz:SN74*1G14: SN74x1G14 - Single Schmitt Triger Inverter Characteristics: VCC: AUP: 0.8 ~ 3.6V LVC: 1.65 ~ 5.5V Operating Temperature: -40°C to 85°C (-40°C to 125°C for LVC Version) fmax = 2.5 MHz (for Vcc =1.65v, high for higher Vcc) Output Current = ± 4 mA (± 32 mA for LVC Version) Digikey: 296-19076-1-ND (AUP Low Voltage, SC-70) <https://www.digikey.com/product-detail/en/texas-instruments/SN74AUP1G14DCKR/296-19076-1-ND/864307> 296-47215-1-ND (LVC High Voltage, SC-70) <https://www.digikey.com/product-detail/en/texas-instruments/SN74LVC1G14DCKR/296-11608-1-ND/385747>; DIGIKEY: 296-11608-1-ND; DISP: SN74LVC1G14; MF: TI; MPN: SN74LVC1G14DCKR
U24 = bschulz:AT24MAC*02: AT24MACx02 - 2kb I2C Serial EEPROM with EUI serial number Characteristics: Vcc: 1.7V ~ 5.5V Memory: 2kb (256 x 8 bit) IQ: 1μA Temperature: -40°C to 85°C Digikey: AT24MAC602-STUM-T (SOT-23, EUI-64) <https://www.digikey.com/en/products/detail/microchip-technology/AT24MAC602-STUM-T/3973073?s=N4IgTCBcDaIIIBUwBYCycDCA2ADGAtAMoICqq%2BCIAugL5A>; DIGIKEY: AT24MAC602-STUM-TCT-ND; DISP: AT24MAC602; MF: Microchip; MPN: AT24MAC602-STUM-T
U25 = bschulz:SN74AUP1T87: SN74AUP1T87 - XNOR, 1 Element, 2 Input Characteristics: VCC: 2.3 ~ 3.6v IQ = 0.1μA Operating Temperature: -40°C to 85°C Digikey: 296-27398-1-ND (SC-70) <https://www.digikey.com/en/products/detail/texas-instruments/SN74AUP1T87DCKR/2280359?s=N4IgTCBcDaIMoDkDsAWAggVQAoEYAqAHEiALoC%2BQA>; DIGIKEY: 296-27398-1-ND; DISP: SN74AUP1T87; MF: TI; MPN: SN74AUP1T87DCKR